# Altium schematic sheet MCU.SchDoc
size A3; SheetNumber: 2; SheetTotal: 4
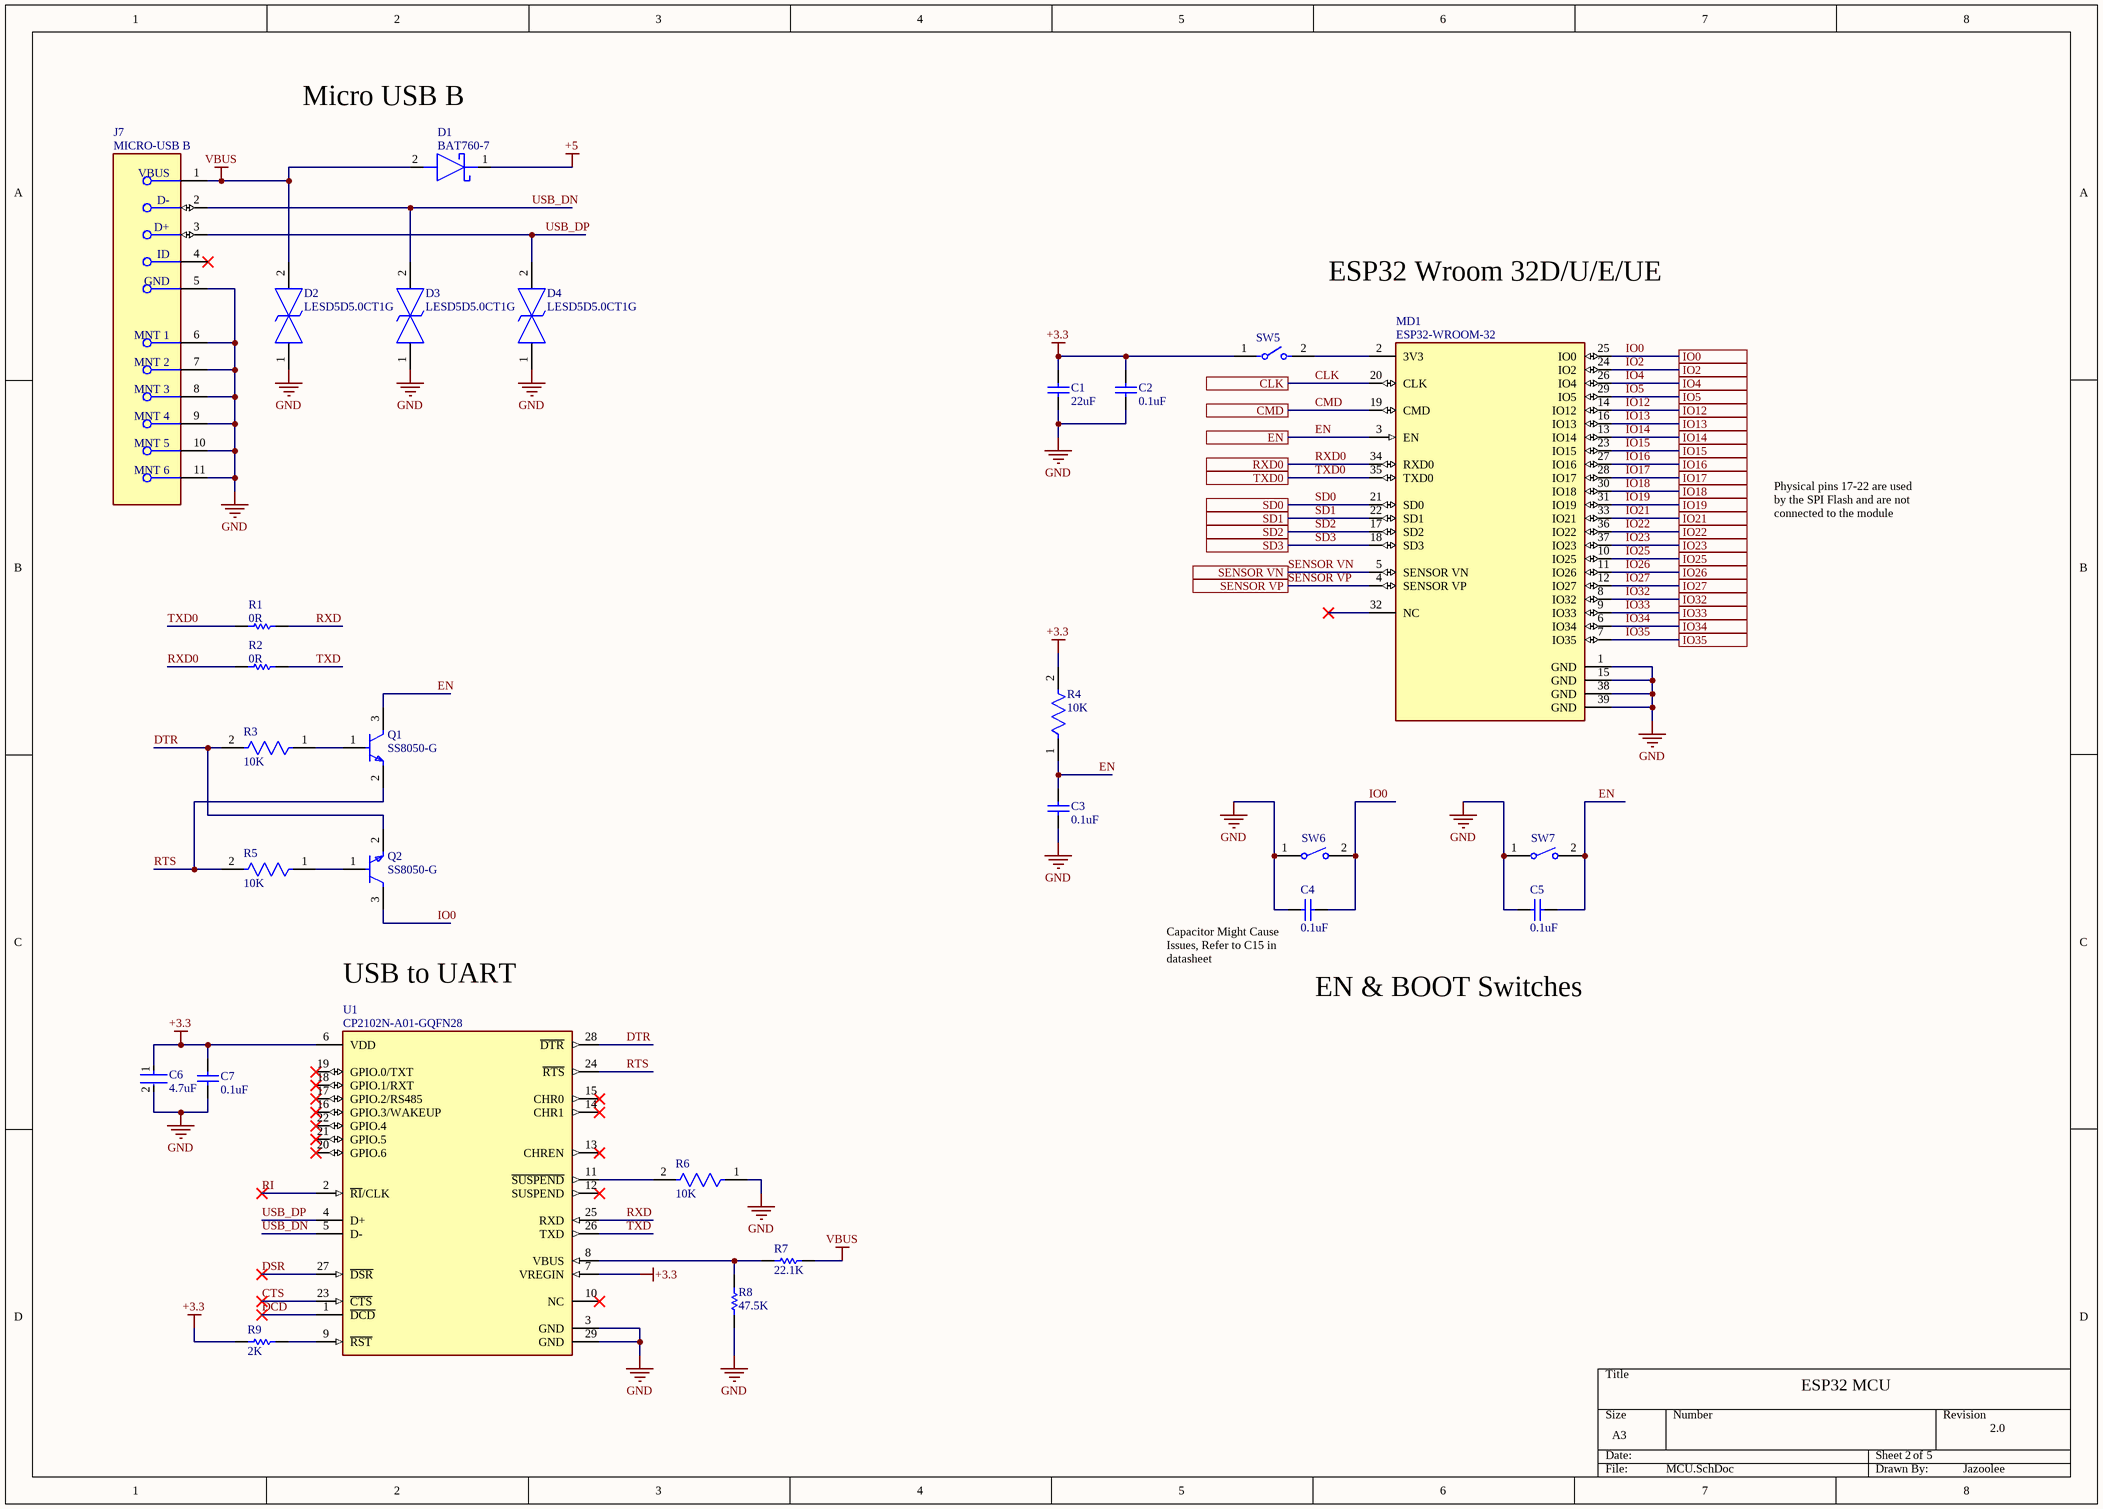
[diagram p0: MCU.SchDoc]

## Parts
C1  value 22uF  [CAPC2014X150X70ML20]  (hidden comment: TACR226M010XTA)
C2  value 0.1uF  [CAPC2013X140X50LL20T25]  (hidden comment: 08055F104KAT2A)
C3  value 0.1uF  [CAPC2013X140X50LL20T25]  (hidden comment: 08055F104KAT2A)
C4  value 0.1uF  [CAPC2013X140X50LL20T25]  (hidden comment: 08055F104KAT2A)
C5  value 0.1uF  [CAPC2013X140X50LL20T25]  (hidden comment: 08055F104KAT2A)
C6  Capacitance: 4.7uF  [FP-CL21-IPC_B]  (hidden comment: CL21A475KQFNNNF)
C7  value 0.1uF  [CAPC2013X140X50LL20T25]  (hidden comment: 08055F104KAT2A)
D1  BAT760-7  [SOD2512X110N]
D2  LESD5D5.0CT1G  [LESD5D50CT1G]
D3  LESD5D5.0CT1G  [LESD5D50CT1G]
D4  LESD5D5.0CT1G  [LESD5D50CT1G]
J7  MICRO-USB B  [FP-473460001-MFG]
MD1  ESP32-WROOM-32  [FP-ESP32-WROOM-32-MFG]
Q1  SS8050-G  [FP-SS8050-G-MFG]
Q2  SS8050-G  [FP-SS8050-G-MFG]
R1  value 0R  [RESC2013X60X35LL10T20]  (hidden comment: RC0805JR-100RL)
R2  value 0R  [RESC2013X60X35LL10T20]  (hidden comment: RC0805JR-100RL)
R3  Resistance: 10K  [FP-RMCF0805-IPC_A]  (hidden comment: RMCF0805JT10K0)
R4  Resistance: 10K  [FP-RMCF0805-IPC_A]  (hidden comment: RMCF0805JT10K0)
R5  Resistance: 10K  [FP-RMCF0805-IPC_A]  (hidden comment: RMCF0805JT10K0)
R6  Resistance: 10K  [FP-RMCF0805-IPC_A]  (hidden comment: RMCF0805JT10K0)
R7  value 22.1K  [RESC2013X50X30LL20T20]  (hidden comment: CRCW080522K1FKTA)
R8  value 47.5K  [RESC2013X70X40NL20T20]  (hidden comment: ERJ-6ENF4752V)
R9  value 2K  [RESC2013X60X35LL10T20]  (hidden comment: RT0805FRE072KL)
SW5  BD01  [FP-BD01-MFG]  (value not drawn)
SW6  FSMSM  [TECO-FSMSM-2_V]  (value not drawn)
SW7  FSMSM  [TECO-FSMSM-2_V]  (value not drawn)
U1  CP2102N-A01-GQFN28  [FP-CP2102N-A01-GQFN28-MFG]

## Ports
CLK (see Main[5B]), CMD (see Main[5B]), EN (see Main[5A]), IO0 (see Main[6B]), IO2 (see Main[6B]), IO4 (see Main[6B]), IO5 (see Main[6B]), IO12 (see Main[5B]), IO13 (see Main[5B]), IO14 (see Main[5B]), IO15 (see Main[6B]), IO16 (see Main[6B]), IO17 (see Main[6B]), IO18 (see Main[6B]), IO19 (see Main[6B]), IO21 (see Main[6A]), IO22 (see Main[6A]), IO23 (see Main[6A]), IO25 (see Main[5A]), IO26 (see Main[6B]), IO27 (see Main[5A]), IO32 (see Main[5A]), IO33 (see Main[5A]), IO34 (see Main[5A]), IO35 (see Main[5A]), RXD0 (see Main[6A]), SD0 (see Main[5B]), SD1 (see Main[5B]), SD2 (see Main[5B]), SD3 (see Main[5B]), SENSOR VN (see Main[5A]), SENSOR VP (see Main[5A]), TXD0 (see Main[6A])

## Nets
+3.3: C1.2 C2.2 C6.1 C7.2 R4.2 R9.2 SW5.1 U1.6(VDD) U1.7(VREGIN)
+5: D1.1(K)
GND: C1.1 C2.1 C3.1 C4.2 C5.2 C6.2 C7.1 D2.1 D3.1 D4.1 J7.5(GND) J7.6(MNT_1) J7.7(MNT_2) J7.8(MNT_3) J7.9(MNT_4) J7.10(MNT_5) J7.11(MNT_6) MD1.1(GND) MD1.15(GND) MD1.38(GND) MD1.39(GND) R6.1 R8.1 SW6.1 SW7.1 U1.3(GND) U1.29(GND)
VBUS: D1.2(A) D2.2 J7.1(VBUS) R7.1
CLK: MD1.20(CLK) ; port CLK
CMD: MD1.19(CMD) ; port CMD
CTS: U1.23(~{CTS})
DCD: U1.1(~{DCD})
DSR: U1.27(~{DSR})
DTR: Q2.2(E) R3.2 U1.28(~{DTR})
EN: C3.2 C5.1 MD1.3(EN) Q1.3(C) R4.1 SW7.2 ; port EN
IO0: C4.1 MD1.25(IO0) Q2.3(C) SW6.2 ; port IO0
IO2: MD1.24(IO2) ; port IO2
IO4: MD1.26(IO4) ; port IO4
IO5: MD1.29(IO5) ; port IO5
IO12: MD1.14(IO12) ; port IO12
IO13: MD1.16(IO13) ; port IO13
IO14: MD1.13(IO14) ; port IO14
IO15: MD1.23(IO15) ; port IO15
IO16: MD1.27(IO16) ; port IO16
IO17: MD1.28(IO17) ; port IO17
IO18: MD1.30(IO18) ; port IO18
IO19: MD1.31(IO19) ; port IO19
IO21: MD1.33(IO21) ; port IO21
IO22: MD1.36(IO22) ; port IO22
IO23: MD1.37(IO23) ; port IO23
IO25: MD1.10(IO25) ; port IO25
IO26: MD1.11(IO26) ; port IO26
IO27: MD1.12(IO27) ; port IO27
IO32: MD1.8(IO32) ; port IO32
IO33: MD1.9(IO33) ; port IO33
IO34: MD1.6(IO34) ; port IO34
IO35: MD1.7(IO35) ; port IO35
RI: U1.2(~{RI}/CLK)
RTS: Q1.2(E) R5.2 U1.24(~{RTS})
RXD: R1.2 U1.25(RXD)
RXD0: MD1.34(RXD0) R2.1 ; port RXD0
SD0: MD1.21(SD0) ; port SD0
SD1: MD1.22(SD1) ; port SD1
SD2: MD1.17(SD2) ; port SD2
SD3: MD1.18(SD3) ; port SD3
SENSOR VN: MD1.5(SENSOR_VN) ; port SENSOR VN
SENSOR VP: MD1.4(SENSOR_VP) ; port SENSOR VP
TXD: R2.2 U1.26(TXD)
TXD0: MD1.35(TXD0) R1.1 ; port TXD0
USB_DN: D3.2 J7.2(D-) U1.5(D-)
USB_DP: D4.2 J7.3(D+) U1.4(D+)
NetMD1_2: MD1.2(3V3) SW5.2
NetQ1_1: Q1.1(B) R3.1
NetQ2_1: Q2.1(B) R5.1
NetR6_2: R6.2 U1.11(~{SUSPEND})
NetR7_2: R7.2 R8.2 U1.8(VBUS)
NetR9_1: R9.1 U1.9(~{RST})

Not connected (* = marked no-connect by the designer): J7 4(ID)*; MD1 32(NC)*; U1 10(NC)* 12(SUSPEND)* 13(CHREN)* 14(CHR1)* 15(CHR0)* 16(GPIO.3/WAKEUP)* 17(GPIO.2/RS485)* 18(GPIO.1/RXT)* 19(GPIO.0/TXT)* 20(GPIO.6)* 21(GPIO.5)* 22(GPIO.4)*

## Notes on the sheet
- Micro USB B
- ESP32 Wroom 32D/U/E/UE
- Physical pins 17-22 are used by the SPI Flash and are not connected to the module
- USB to UART
- (near C4) Capacitor Might Cause Issues, Refer to C15 in datasheet
- EN & BOOT Switches
- ESP32 MCU
- 2
- 5
- 2.0
- Jazoolee

## Library data of the parts
C1 = CMP-2007-00033-1: 22uF 10V 20% Tantalum 0805; Manufacturer: AVX Interconnect / Elco; Part Number: TACR226M010XTA
C2-C5 C7 = CMP-2007-04784-1: 100nF 0805 Ceramic 50V 10%; Manufacturer: AVX Interconnect / Elco; Part Number: 08055F104KAT2A
C6 = CMP-13271-001343-1: CL21 Series 0805 4.7uF 6.3V ±10% Tolerance X5R Multilayer Ceramic Chip Capacitor; Case/Package: 0805; Length: 2mm; Width: 0.049inch; Thickness: 0.053inch; Package Quantity: 10000; Voltage Rating: 6.3V; Depth: 1.25mm; Radiation Hardening: No; Tolerance: 10%; Dielectric: X5R; Height: 1.25mm; Packaging: Tape and Reel; Min Operating Temperature: -55°C; Max Operating Temperature: 85°C; Mount: Surface Mount
D1 = BAT760,115: Schottky Diode; Manufacturer_Name: Nexperia; Datasheet Link: https://assets.nexperia.com/documents/data-sheet/BAT760.pdf; Height: 1.1mm; Manufacturer_Part_Number: BAT760,115; Mouser Part Number: 771-BAT760-T/R; Mouser Price/Stock: https://www.mouser.co.uk/ProductDetail/Nexperia/BAT760115?qs=me8TqzrmIYUT08NCquDVCQ%3D%3D; Arrow Part Number: BAT760,115; Arrow Price/Stock: https://www.arrow.com/en/products/bat760115/nexperia?region=europe
D2-D4 = LESD5D5.0CT1G: TVS Diode (Bi-directional); Manufacturer_Name: LRC; Height: 0.7mm; Manufacturer_Part_Number: LESD5D5.0CT1G
J7 = CMP-2000-05246-2: CONN RCPT USB2.0 MICRO B SMD R/A; Manufacturer: Molex; Manufacturer Part Number: 473460001; Conn Orientation: Right Angle; Is Female: yes; Shielding: true; Pitch: 0.65mm; Number Of Contacts: 5; Description: USB - micro B USB 2.0 Receptacle Connector 5 Position Surface Mount, Right Angle; Voltage Rating: 30V; Current Rating: 1.8A; Device Class L2: USB Connectors; Digikey Description: CONN RCPT USB2.0 MICRO B SMD R/A; Height: 2.945mm; RoHS: TRUE; ComponentLink2Description: Datasheet; Octopart: https://octopart.com/47346-0001-molex-7164928; Automotive: No; Package: 0; Category: Conn; Device Class L1: Connectors; Usb Standard: USB 2.0; Temperature: -30°C to +85°C; Temperature Range Low: -30°C; Footprint Url: https://www.molex.com/pdm_docs/sd/473460001_sd.pdf; ComponentLink2URL: https://www.molex.com/webdocs/datasheets/pdf/en-us/0473460001_IO_CONNECTORS.pdf; Lead Free: Yes; Contact Material: Gold,Nickel; Temperature Range High: +85°C; Device Class L3: unset
MD1 = CMP-194065-000008-1: RX TXRX MOD WIFI SURFACE MOUNT; Frequency: 2.5GHz; Sensitivity: -98dBm; Operating Supply Voltage: 3.6V; Data Rate: 150Mbps; Weight: 0.088185oz; Package Quantity: 550; Min Operating Temperature: -40°C; Mount: Surface Mount; Max Operating Temperature: 85°C; Packaging: Cut Tape; Case/Package: SMD/SMT
Q1 Q2 = CMP-20235-000001-1: NPN TRANSISTOR 1.5A 40V SOT-23 R; Transition Frequency: 100MHz; Max Breakdown Voltage: 25V; Collector Emitter Voltage (VCEO): 400mV; Max Power Dissipation: 300mW; Max Collector Current: 1.5A; Case/Package: TO-236-3; Packaging: Tape and Reel; RoHS Compliant: Yes; Mount: Surface Mount; Collector Emitter Breakdown Voltage: 25V
R1 R2 = CMP-2000-06963-1: Chip Resistor, 0 Ohm, +/- 5%, 125 mW, -55 to 155 degC, 0805 (2012 Metric), RoHS, Tape and Reel; Manufacturer: Yageo; Product Length (mm): 2mm; Tolerance (+ or -): NotRequired; Case Style: Molded; Product Height (mm): 0.5mm; Power Rating(s): NotRequiredW; Product Depth (mm): 1.25mm; Mounting Technology: SurfaceMount; Military Standard: NotRequired; Operating Temp Range: -55Cto155C; Temperature Coefficient: NotRequired; Package Description: 2-Pin Surface Mounted Device, Body 2 x 1.25 mm; Datasheet Version: Rev. 7, 05/2017; Failure Rate: NotRequired; Manufacturer URL: http://www.yageo.com/; Datasheet URL: http://www.yageo.com/documents/recent/PYu-RC_Group_51_RoHS_L_7.pdf; Packaging: TapeandReel; Package Reference: 0805; Package / Case: 0805; Termination Style: NotRequired; Type: ThickFilm; Construction: Rectangular
R3-R6 = CMP-26527-002663-1: 10kΩ ±5% 0.125W 0805 Thick Film Chip Resistor AEC-Q200 compliant; Max Power Dissipation: 125mW; Temperature Coefficient: 100ppm/°C; Construction: Rectangular; RoHS Compliant: Yes; Resistor Type: Thick Film; Series: RMCF; Features: Automotive AEC-Q200; Case Code (Imperial): 0805; Mount: Surface Mount; Min Operating Temperature: -55°C; Military Standard: Not; Tolerance: 5%; Size Code: 0805; Contact Plating: Tin; Length: 2mm; Depth: 1.25mm; Case Code (Metric): 2012; Packaging: Tape and Reel; Radiation Hardening: No; Height: 0.026inch; Case/Package: 0805; Width: 0.049inch; Lead Free: Lead Free; Max Operating Temperature: 155°C; Number of Terminations: 2; Power Rating: 125mW
R7 = CMP-1013-00660-2: 22.1K 0805 5%; Manufacturer: Vishay Dale; Part Number: CRCW080522K1FKTA
R8 = CMP-1013-00700-2: 47.5K 0805 5%; Manufacturer: Panasonic; Part Number: ERJ-6ENF4752V
R9 = CMP-2001-01475-1: Manufacturer: Yageo; Part Number: RT0805FRE072KL
SW5 = CMP-10033-000004-1: SWITCH SLIDE DIP SPST 100MA 5V; Max Voltage Rating (DC): 25V; Contact Current Rating: 25mA; Pitch: 0.1inch; Number of Circuits: 1; Actuator Material: Nylon; Life (Cycles): 10000Cycles; Body Material: PBT; Approvals: UL; Actuator Type: Slide (Standard); Washable: Yes; Actuator Length: 0.9mm; Capacitance: 5pF; Length: 0.18inch; Lead Free: Lead Free; Material: Nylon; Termination: PC Pin; Orientation: Straight; Throw Configuration: SPST; Case/Package: DIP; Package Quantity: 115; Packaging: Rail/Tube; Number of Positions: 1; Max Operating Temperature: 85°C; Terminal Pitch: 2.54mm; Mount: Through Hole; Min Operating Temperature: -40°C; RoHS Compliant: Yes; Depth: 9.65mm; Electrical Life: 10000Cycles; Series: BD; Contact Material: Bronze; Max Current Rating: 100mA; Current Rating: 100mA; Mechanical Life: 10000Cycles; Number of Poles: 1; REACH SVHC: No SVHC; Contact Plating: Gold; Radiation Hardening: No; Width: 9.65mm; Voltage Rating (DC): 5V
SW6 SW7 = CMP-2000-07511-1: FSMSM Push Button Switch, 50 mA, -35 to 85 degC, 2-Pin SMD, RoHS, Bulk; Manufacturer: TE Connectivity; Actuator Length: 1.07mm; Electrical Life: 20000Cycles; Actuator Material: Polyamide; Current Rating: 50mA; Illumination Type: Illuminated; Voltage Rating (DC): 24V; Contact Resistance: 100mOhm; Case\/Package: SMD/SMT; Operating Force: 180gf; Switch Travel: 0.25mm; Max Voltage Rating (DC): 12V; Throw Configuration: SPST; Packaging: LoosePiece; Max Operating Temperature: 85degC; ELV: Compliant; Package Description: 2-Pin Surface Mount Device, Body 6 x 3.5 mm, Pitch 9.19 mm; RoHSCompliant: true; Manufacturer URL: http://www.te.com/; Contact Plating: Silver; Contact Material: Brass; Mounting Technology: SurfaceMount; Contact Current Rating: 50mA; Datasheet Version: Rev. C2, 08/2014; Datasheet URL: http://www.te.com/commerce/DocumentDelivery/DDEController?Action=showdoc&DocId=Customer+Drawing%7F1437566-3%7FC2%7Fpdf%7FEnglish%7FENG_CD_1437566-3_C2_1437566_3_1_c.dwg.pdf%7F1437566-3; Mechanical Life: 20000Cycles; Package Reference: FSMSM; REACH SVHC: Unknown; Orientation: Straight; Min Operating Temperature: -35degC; Lead Free: LeadFree; Termination: GullWing; Package Quantity: 1000; Mount: SurfaceMount
U1 = CMP-08093-000004-1: IC BRIDGE USB TO UART 28QFN; Manufacturer: Silicon Labs; Standoff Height: 0mm; Max Junction Temp: +105°C; Usb Standard: USB 2.0; Number Of Ports: 1; Nominal Supply Current: 195-13700uA; Min Supply Voltage: 1.71V; Max Supply Voltage: 5.25V; Interface: UART,USB,RS-232,RS-485; Height: 0.8mm; Package: CP2102N-A01-GQFN28; Temperature Range Low: -40°C; Lead Free: Yes; Category: IC; Ambient Temperature Range High: +85°C; Device Class L3: USB Interface ICs; Octopart: https://octopart.com/cp2102n-a01-gqfn28-silicon+labs-74636024; Manufacturer Part Number: CP2102N-A01-GQFN28; Device Class L2: Interface ICs; ComponentLink2URL: https://media.digikey.com/pdf/Data%20Sheets/Silicon%20Laboratories%20PDFs/CP2102N_Rev.1.3_DS.pdf; Automotive: No; Temperature: -40°C to +85°C; Device Class L1: Integrated Circuits (ICs); Mouser Description: IC BRIDGE USB TO UART 28QFN; RoHS: TRUE; Ambient Temperature Range Low: -40°C; Temperature Range High: +85°C; Ipc Land Pattern Name: QFN50P500X500X75-28; Digikey Description: IC BRIDGE USB TO UART 28QFN; ComponentLink2Description: Datasheet